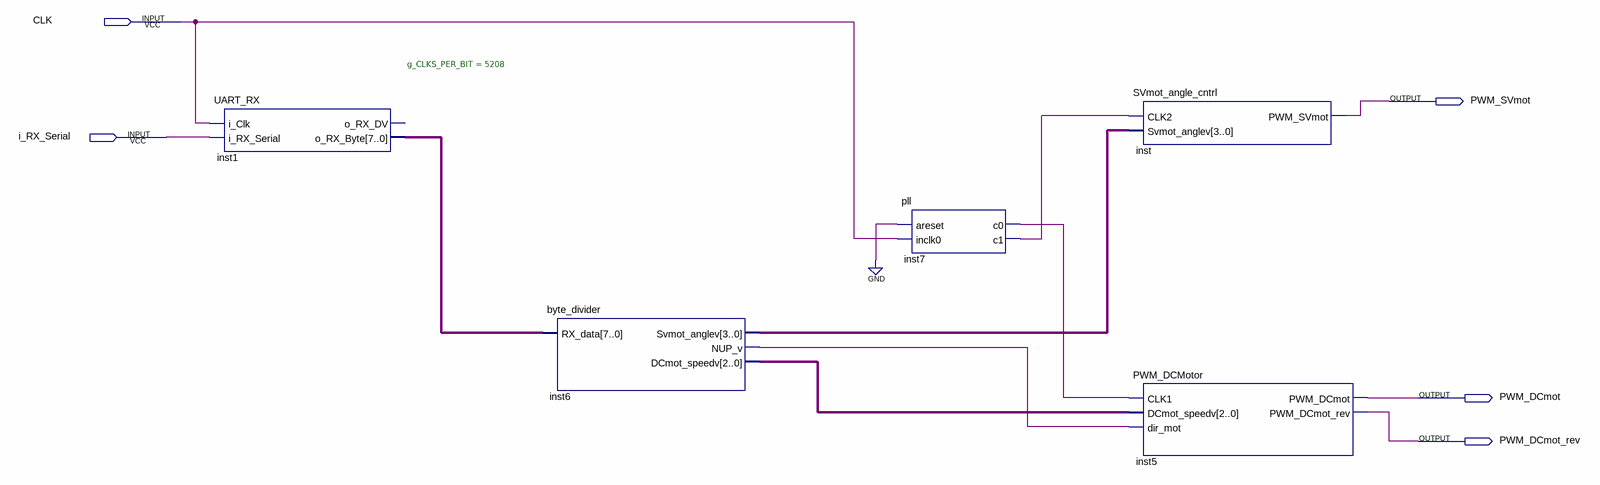
[diagram p0: schematic sheet]
// Quartus schematic Main.bdf as structural Verilog: 5 symbols, 5 pins
module Main (
  input  CLK,
  input  i_RX_Serial,
  output PWM_SVmot,
  output PWM_DCmot,
  output PWM_DCmot_rev
);

  wire inst6_nup_v, inst7_c0, inst7_c1;
  wire [2:0] inst6_dcmot_speedv;
  wire [3:0] inst6_svmot_anglev;
  wire [7:0] inst1_o_rx_byte;

  UART_RX #(.g_CLKS_PER_BIT(5208)) inst1 (
    .i_Clk(CLK), .i_RX_Serial(i_RX_Serial), .o_RX_Byte(inst1_o_rx_byte));  // open: o_RX_DV
  byte_divider inst6 (
    .RX_data(inst1_o_rx_byte), .Svmot_anglev(inst6_svmot_anglev), .NUP_v(inst6_nup_v),
    .DCmot_speedv(inst6_dcmot_speedv));
  pll inst7 (.areset(1'b0), .inclk0(CLK), .c0(inst7_c0), .c1(inst7_c1));
  SVmot_angle_cntrl inst (.CLK2(inst7_c1), .Svmot_anglev(inst6_svmot_anglev), .PWM_SVmot(PWM_SVmot));
  PWM_DCMotor inst5 (
    .CLK1(inst7_c0), .DCmot_speedv(inst6_dcmot_speedv), .dir_mot(inst6_nup_v), .PWM_DCmot(PWM_DCmot),
    .PWM_DCmot_rev(PWM_DCmot_rev));
endmodule
